# Altium schematic sheet HT62N_v1.1.SchDoc
size 431 x 279 mm; SheetNumber: 1; SheetTotal: 1
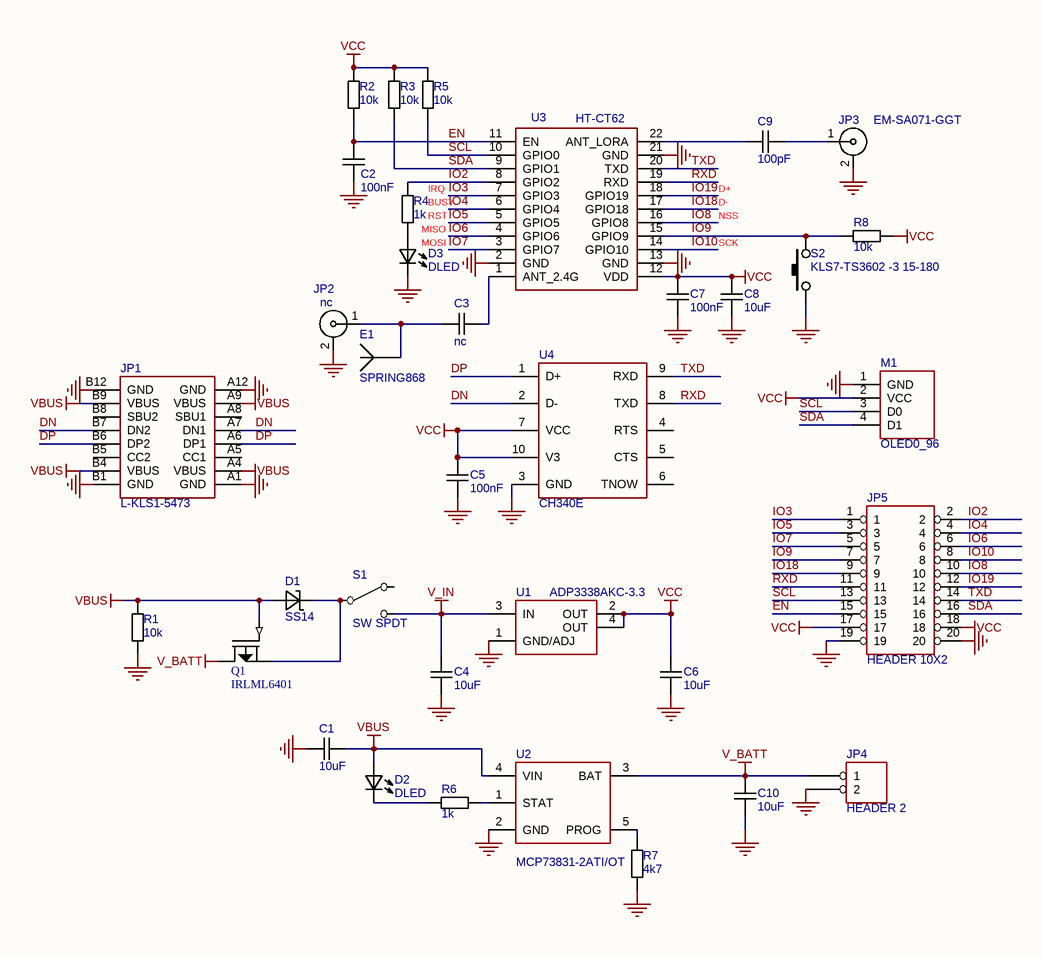
[diagram p0: HT62N_v1.1.SchDoc]

## Parts
C1  10uF  [C-0805]
C2  100nF  [C-0603]
C3  nc  [C-0603]
C4  10uF  [C-0805]
C5  100nF  [C-0603]
C6  10uF  [C-0805]
C7  100nF  [C-0603]
C8  10uF  [C-0805]
C9  100pF  [C-0603]
C10  10uF  [C-0805]
D1  SS14  [D-SMA]
D2  DLED  [LED_3mm_RED]
D3  DLED  [LED_3mm_RED]
E1  SPRING868  [ANT_H868_V]
JP1  L-KLS1-5473  [USB_C_SMD_SLOT]
JP2  nc  [SMA_F_EDGE]
JP3  EM-SA071-GGT  [SMA_F_EDGE]
JP4  HEADER 2  [PLS1-2]
JP5  HEADER 10X2  [PLS2_10]
M1  OLED0_96  [OLED096_I2C]
Q1  IRLML6401  [SOT-23]
R1  10k  [R-0603]
R2  10k  [R-0603]
R3  10k  [R-0603]
R4  1k  [R-0603]
R5  10k  [R-0603]
R6  1k  [R-0603]
R7  4k7  [R-0603]
R8  10k  [R-0603]
S1  SW SPDT  [SK-12D07VG5]
S2  KLS7-TS3602 -3 15-180  [KLS7-TS3602]
U1  ADP3338AKC-3.3  [SOT223]
U2  MCP73831-2ATI/OT  [SOT-23-5]
U3  HT-CT62  [HT-CT62]
U4  CH340E  [MSOP-10]

## Nets
GND: C1.1 C2.1 C4.2 C5.1 C6.2 C7.1 C8.2 C10.1 D3.2 JP1.A1(GND) JP1.A12(GND) JP1.B1(GND) JP1.B12(GND) JP2.2 JP3.2 JP4.2 JP5.19 JP5.20 M1.1(GND) R1.1 R7.1 S2.1 U1.1(GND/ADJ) U2.2(GND) U3.2(GND) U3.13(GND) U3.21(GND) U4.3(GND)
V_BATT: C10.2 JP4.1 Q1.3(DRAIN) U2.3(BAT)
V_IN: C4.1 S1.3(NO) U1.3(IN)
VBUS: C1.2 D1.1 D2.1 JP1.A4(VBUS) JP1.A9(VBUS) JP1.B4(VBUS) JP1.B9(VBUS) Q1.1(GATE) R1.2 U2.4(VIN)
VCC: C5.2 C6.1 C7.2 C8.1 JP5.17 JP5.18 M1.2(VCC) R2.1 R3.1 R5.1 R8.1 U1.2(OUT) U1.4(OUT) U3.12(VDD) U4.7(VCC) U4.10(V3)
DN: JP1.A7(DN1) JP1.B7(DN2) U4.2(D-)
DP: JP1.A6(DP1) JP1.B6(DP2) U4.1(D+)
EN: C2.2 JP5.15 R2.2 U3.11(EN)
IO2: JP5.2 R4.2 U3.8(GPIO2)
IO3: JP5.1 U3.7(GPIO3)
IO4: JP5.4 U3.6(GPIO4)
IO5: JP5.3 U3.5(GPIO5)
IO6: JP5.6 U3.4(GPIO6)
IO7: JP5.5 U3.3(GPIO7)
IO8: JP5.10 U3.16(GPIO8)
IO9: JP5.7 R8.2 S2.2 U3.15(GPIO9)
IO10: JP5.8 U3.14(GPIO10)
IO18: JP5.9 U3.17(GPIO18)
IO19: JP5.12 U3.18(GPIO19)
RXD: JP5.11 U3.19(RXD) U4.8(TXD)
SCL: JP5.13 M1.3(D0) R5.2 U3.10(GPIO0)
SDA: JP5.16 M1.4(D1) R3.2 U3.9(GPIO1)
TXD: JP5.14 U3.20(TXD) U4.9(RXD)
NetC3_1: C3.1 E1.1 JP2.1
NetC3_2: C3.2 U3.1(ANT_2.4G)
NetC9_1: C9.1 U3.22(ANT_LORA)
NetC9_2: C9.2 JP3.1
NetD1_2: D1.2 Q1.2(SOURCE) S1.2(COMMON)
NetD2_2: D2.2 R6.2
NetD3_1: D3.1 R4.1
NetR6_1: R6.1 U2.1(STAT)
NetR7_2: R7.2 U2.5(PROG)

Not connected (* = marked no-connect by the designer): JP1 17(VSS) A5(CC1) A8(SBU1) B5(CC2) B8(SBU2); S1 1(NC); U4 4(RTS) 5(CTS) 6(TNOW)

## Notes on the sheet
- (near R4) IRQ
- D+
- MOSI
- MISO
- RST
- (near R4) BUSY
- SCK
- NSS
- D-
- DWG. NO.
- REV.
- SHT.
- THIS DOCUMENT AND THE DATA DISCLOSED HEREIN OR HEREWITH IS THE PROPERTY OF ALTIUM LIMITED AND MAY BE FREELY DISTRIBUTED IN WHOLE. NO RIGHTS ARE RESERVED OR EXPRESS OR IMPLIED WARANTEE GIVEN.
- REVISION
- DESCRIPTION
- DATE
- APPROVED
- ENG:
- APPROVALS
- PROJECT
- DSN:
- CHK:
- REFERENCE DOCUMENTS
- PROJECT REVISION:
- TITLE
- DOCUMENT REVISION:
- DESIGN ITEM:
- BOM:
- FAB DWG:
- PCB DWG:
- ASSY DWG:
- SCALE:
- SIZE
- B
- CAGE CODE
- FILE NAME
- DWG NO.
- SHEET
- OF
- REV

## Library data of the parts
C1-C10 = CAPN: Voltage: 50V; Точність/група: NP0; Вид: Конденсатор
D1 = DIODSH: Вид: Діод
D2 D3 = DLED: Вид: Світлодіод
E1 = ANT: Примітки: Пряма; Вид: Антена
JP1 = L-KLS1-5473: Mounting  Method: SMD; Value: *
JP2 JP3 = SMA: SMA Female R/A PCB Mount; Вид: Роз'єм
JP4 = HEADER 2: Вид: Роз'єм; *: *
JP5 = HEADER 10X2: Вид: Роз'єм; *: *
M1 = OLED0_96_I2C
Q1 = MOSF-P: Вид: Транзистор
R1-R8 = RES: Точність/група: 5%; Вид: Резистор
S1 = SW SPDT: Вид: Перемикач; Виробник: *; *: *
S2 = SW-1: Вид: Кнопка; Робоча напруга: *
U1 = LDL1117: LOW CURRENT ADJUSTABLE  VOLTAGE REGULATOR; Вид: Мікросхема
U2 = MCP73831-2ATI/OT: Library Part: IC`s.SchLib; Manufacturer: Texas Instruments; Man#Part Num#: TPS61023DRLT; Value: {Value}; Mounting  Method: SMD; IC Type: PMIC; Part Number: MCP73831-2ATI/OT; Footprint Part: IC-package.PcbLib; Package: SOT-563; Part Type: IC; Component Type: SMD; Temperature Range: -40°C ~ 125°C (TJ); URL: https://www.ti.com/general/docs/suppproductinfo.tsp?distId=10&gotoUrl=https%3A%2F%2Fwww.ti.com%2Flit%2Fgpn%2Ftps61023; Suplier 1: https://www.digikey.com.au/en/products/detail/texas-instruments/TPS61023DRLT/11310622?s=N4IgTCBcDaICoAUDKA2AjABjAZgCICUAZOEAXQF8g
U4 = CH340E: Value: {Value}; Mounting  Method: SMD
U3 = HT-CT62: Value: HT-CT62